# Altium project PCB_Raspi_4B.PrjPcb
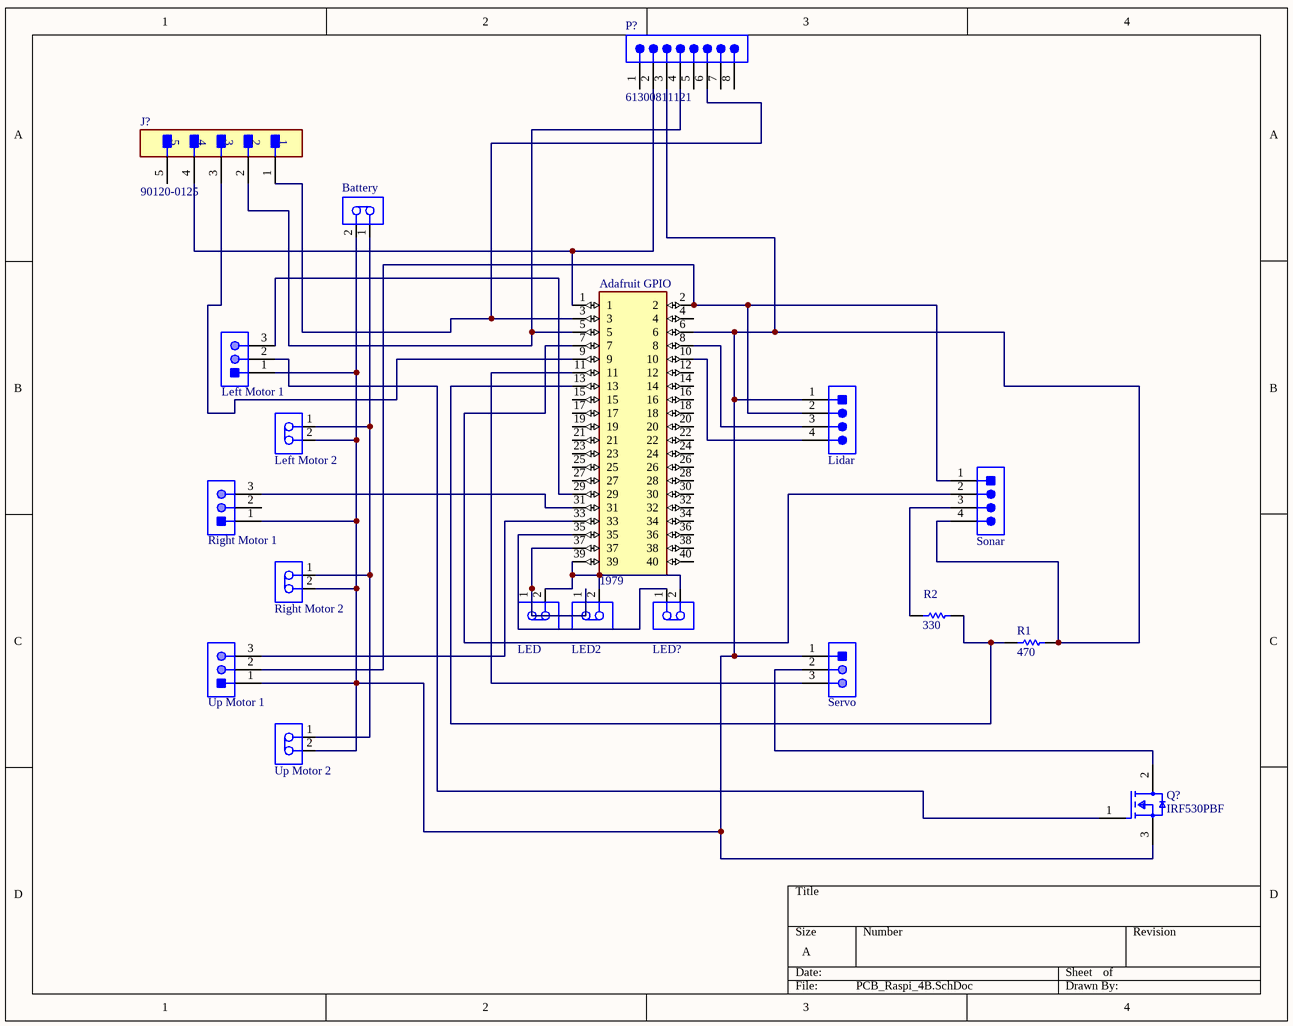
[diagram p0: PCB_Raspi_4B.SchDoc]
1 sheet, 19 parts. Net scope: global (net labels, ports and power ports of the same name join across sheets).
Board file: PCB_Raspi_4B.PcbDoc

## Sheet PCB_Raspi_4B.SchDoc
size A; SheetNumber: 1; SheetTotal: 1

### Parts
Adafruit_GPIO  1979  [RHDR40W60P250_2X20_5100X500X23]
Battery  B2B-PH-K-S(LF)(SN)  [JST-B2B-PH-K-S_V]  (value not drawn)
J?  90120-0125  [FP-90120-0125-MFG]
LED  B2B-PH-K-S(LF)(SN)  [JST-B2B-PH-K-S_V]  (value not drawn)
LED2  B2B-PH-K-S(LF)(SN)  [JST-B2B-PH-K-S_V]  (value not drawn)
LED?  B2B-PH-K-S(LF)(SN)  [JST-B2B-PH-K-S_V]  (value not drawn)
Left_Motor_1  B3B-PH-K-S(LF)(SN)  [JST-B3B-PH-K-S-3_V]  (value not drawn)
Left_Motor_2  B2B-PH-K-S(LF)(SN)  [JST-B2B-PH-K-S_V]  (value not drawn)
Lidar  B4B-PH-K-S(LF)(SN)  [JST-B4B-PH-K-S_V]  (value not drawn)
P?  61300811121  [61300811121]
Q?  IRF530PBF  [FP-X15-0364-MFG]
R1  470  [RESA60-630X240]
R2  330  [RESA60-630X240]
Right_Motor_1  B3B-PH-K-S(LF)(SN)  [JST-B3B-PH-K-S-3_V]  (value not drawn)
Right_Motor_2  B2B-PH-K-S(LF)(SN)  [JST-B2B-PH-K-S_V]  (value not drawn)
Servo  B3B-PH-K-S(LF)(SN)  [JST-B3B-PH-K-S-3_V]  (value not drawn)
Sonar  B4B-PH-K-S(LF)(SN)  [JST-B4B-PH-K-S_V]  (value not drawn)
Up_Motor_1  B3B-PH-K-S(LF)(SN)  [JST-B3B-PH-K-S-3_V]  (value not drawn)
Up_Motor_2  B2B-PH-K-S(LF)(SN)  [JST-B2B-PH-K-S_V]  (value not drawn)

### Nets
NetAdafruit_GPIO_1: Adafruit_GPIO.1 J?.4 P?.2
NetAdafruit_GPIO_2: Adafruit_GPIO.2 Lidar.2 Sonar.1 Up_Motor_1.2
NetAdafruit_GPIO_3: Adafruit_GPIO.3 J?.1 P?.6
NetAdafruit_GPIO_5: Adafruit_GPIO.5 J?.2 P?.4
NetAdafruit_GPIO_6: Adafruit_GPIO.6 Battery.2 Left_Motor_1.1 Left_Motor_2.2 Lidar.1 P?.3 Q?.3(S) R1.1 Right_Motor_1.1 Right_Motor_2.2 Servo.1 Sonar.4 Up_Motor_1.1 Up_Motor_2.2
NetAdafruit_GPIO_7: Adafruit_GPIO.7 Sonar.2
NetAdafruit_GPIO_8: Adafruit_GPIO.8 Lidar.3
NetAdafruit_GPIO_9: Adafruit_GPIO.9 J?.3
NetAdafruit_GPIO_10: Adafruit_GPIO.10 Lidar.4
NetAdafruit_GPIO_11: Adafruit_GPIO.11 Servo.3
NetAdafruit_GPIO_13: Adafruit_GPIO.13 R1.2 R2.1
NetAdafruit_GPIO_29: Adafruit_GPIO.29 Left_Motor_1.3
NetAdafruit_GPIO_31: Adafruit_GPIO.31 Right_Motor_1.3
NetAdafruit_GPIO_33: Adafruit_GPIO.33 Up_Motor_1.3
NetAdafruit_GPIO_35: Adafruit_GPIO.35 LED?.1
NetAdafruit_GPIO_37: Adafruit_GPIO.37 LED.1 LED2.1
NetAdafruit_GPIO_39: Adafruit_GPIO.39 LED.2 LED2.2 LED?.2
NetBattery_1: Battery.1 Left_Motor_2.1 Right_Motor_2.1 Up_Motor_2.1
NetLeft_Motor_1_2: Left_Motor_1.2 Q?.1(G)
NetQ?_2: Q?.2(D) Servo.2
NetR2_2: R2.2 Sonar.3

Not connected (* = marked no-connect by the designer): Adafruit_GPIO 4 12 14 15 16 17 18 19 20 21 22 23 24 25 26 27 28 30 32 34 36 38 40; J? 5; P? 1 5 7 8; Right_Motor_1 2

### Library data of the parts
Adafruit_GPIO = CMP-002-00071-1: Stacking Header for Pi A+/B+/Pi 2/Pi 3 - 2x20 Extra Tall Header; MF: Adafruit Industries; Pins: 40; MP: 1979; SnapEDA_Link: https://www.snapeda.com/parts/1979/Adafruit+Industries+LLC/view-part/?ref=snap; Source: 1979.SchLib; Design Item ID: 1979; Value: *; Check_prices: https://www.snapeda.com/parts/1979/Adafruit+Industries+LLC/view-part/?ref=eda; Case/Package: None; Component Type: Standard
Battery LED Left_Motor_2 Right_Motor_2 Up_Motor_2 = CMP-2000-05162-1: Male Header, Pitch 2 mm, 1 x 2 Position, Height 6 mm, Tail Length 3.4 mm, -25 to 85 degC, RoHS, Bulk; Manufacturer: JST; Pitch: 2mm; Style/Orientation: StraightHeader/Plug; No of Positions: 2; Datasheet Version: Nov-08; Datasheet URL: http://datasheet.octopart.com/B2B-PH-K-S%28LF%29%28SN%29-JST-datasheet-8324864.pdf; Manufacturer URL: http://www.jst.com/home2.html; Type: ShroudedHeader; Termination: Crimp
J? = CMP-00257-00655425-1: 90120-0125 2.54mm Pitch C-Grid III Header, Single Row, Vertical, 5 Circuits, Tin (Sn) Plating; NexarPartId: 655425; Manufacturer Lifecycle Status: ACTIVE; Lead Length: 2.9mm; Number of Positions: 5; Current Rating: 3A; Mating Post Length: 6.75mm; Glow Wire Compliant: Non-compliant; Contact Resistance: 20mΩ; Voltage Rating: 350V; Gender: Male; Max Voltage Rating (DC): 350.35kV; Max Operating Temperature: 125°C; Number of Pins: 5; Plating: Tin; Contact Material: Brass; Mount: Through Hole; Contact Gender: Male; Packaging: Bulk; Schedule B: 8536694040; Lifecycle Status: Production; Lead Pitch: 2.54mm; Radiation Hardening: No; Orientation: Vertical; Min Operating Temperature: -55°C; Country of Origin: SK; Housing Color: Black; REACH SVHC: No SVHC; Contact Plating: Tin; Number of Rows: 1; Number of Circuits: 5; Termination: Solder; Number of Contacts: 5; Pitch: 2.54mm; Housing Material: Polyester; RoHS: Compliant; Lead Free: Lead Free; Voltage Rating (AC): 350V
LED2 LED? = CMP-2000-05162-1: Male Header, Pitch 2 mm, 1 x 2 Position, Height 6 mm, Tail Length 3.4 mm, -25 to 85 degC, RoHS, Bulk; Manufacturer: JST; Pitch: 2mm; Style/Orientation: StraightHeader/Plug; No of Positions: 2; Type: ShroudedHeader; Datasheet Version: Nov-08; Datasheet URL: http://datasheet.octopart.com/B2B-PH-K-S%28LF%29%28SN%29-JST-datasheet-8324864.pdf; Manufacturer URL: http://www.jst.com/home2.html; Termination: Crimp
Left_Motor_1 Right_Motor_1 Servo Up_Motor_1 = CMP-2000-05164-1: Male Header, Pitch 2 mm, 1 x 3 Position, Height 6 mm, Tail Length 3.4 mm, -25 to 85 degC, RoHS, Bulk; Manufacturer: JST; Style/Orientation: StraightHeader/Plug; Pitch: 2mm; No of Positions: 3; Termination: Crimp; Manufacturer URL: http://www.jst.com/home2.html; Datasheet Version: Oct-06; Type: ShroudedHeader; Datasheet URL: https://datasheet.ciiva.com/11746/0900766b80826550-11746939.pdf
Lidar Sonar = CMP-2000-05165-1: Male Header, Pitch 2 mm, 1 x 4 Position, Height 6 mm, Tail Length 3.4 mm, -25 to 85 degC, RoHS, Bulk; Manufacturer: JST; No of Positions: 4; Style/Orientation: StraightHeader/Plug; Pitch: 2mm; Datasheet URL: http://datasheet.octopart.com/B4B-PH-K-S%28LF%29%28SN%29-JST-datasheet-10558886.pdf; Type: ShroudedHeader; Manufacturer URL: http://www.jst.com/home2.html; Termination: Crimp; Datasheet Version: Apr-09
P? = CMP-1502-01076-3: NexarPartId: 32855533; Connector Type: Male Pin; Number of Contacts: 8; Voltage Rating: 250V; Current Rating: 3A; Contact Resistance: 20mΩ; Pitch: 2.54mm; Gender: Male; Termination: Solder; Contact Material: Copper; Mount: Through Hole; Lead Pitch: 2.54mm; Number of Positions: 8; Operating Supply Voltage: 250V; Number of Pins: 8; Max Operating Temperature: 105°C; Height: 8.54mm; REACH SVHC: Unknown; Number of Rows: 1; Packaging: Bulk; Contact Plating: Gold; Contact Mating Length: 5.9944mm; Orientation: Vertical; RoHS: Compliant; Color: Black; Min Operating Temperature: -40°C
Q? = CMP-02550-000190-1: MOSFET N-CH 100V 14A TO-220AB; Manufacturer: Vishay; Reverse Recovery Charge: 850nC; Rthja Max: 62°C/W; Power Dissipation: 88W; Depletion Mode: False; Input Capacitace At Vds: 670pF @ 25V; Pulse Drain Current: 56A; Turn On Delay Time: 10ns; Drain To Source Resistance: 0.16Ω; Number Of N Channels: 1; Max Junction Temp: +175°C; Threshold Vgs Max: 4V; Standoff Height: 3.33mm; Max Forward Diode Voltage: 2.5V; Turn Off Delay Time: 23ns; Gate To Source Voltage: 20V; Threshold Vgs Min: 2V; Reverse Recovery Time: 150ns; Gate Charge At Vgs: 26nC @ 10V; Temperature: -55°C to +175°C; Drain To Source Voltage: 100V; Mouser Description: MOSFET N-Chan 100V 14 Amp; Device Class L2: Transistors; Temperature Range High: +175°C; ComponentLink2URL: http://www.vishay.com/docs/91019/91019.pdf; Lead Free: Yes; Height: 19.89mm; Octopart: https://octopart.com/irf530pbf-vishay-46547999; Category: Trans; ComponentLink2Description: Datasheet; RoHS: TRUE; Device Class L3: MOSFETs; Automotive: No; Device Class L1: Discrete Semiconductors; Package: X15-0364; Manufacturer Part Number: IRF530PBF; Continuous Drain Current: 14A; Digikey Description: MOSFET N-CH 100V 14A TO-220AB; Number Of Channels: 1; Drain To Source Breakdown Voltage: 100V; Temperature Range Low: -55°C
R1 R2 = CMP-1659-00073-1: Axial Resistor, 100 KOhm, +/- 1%, 0.25 W, -55 to 155 degC, 2-Pin THD, RoHS, Bulk; Voltage Rating: 250 V; Power Rating: 250 mW; Resistance: 475 Ohm; PackageDescription: 2-Pin Axial Lead, Dia 2.4 mm, Body Length 6.3 mm; PackageReference: MFR-25; Length: 0.248 inch; ComponentLink2Description: Datasheet; Packaging: Bulk; DatasheetVersion: Apr-13; Package Quantity: 200; Min Operating Temperature: -55 degC; ComponentLink2URL: http://www.yageo.com/documents/recent/Yageo%20LR_MFR_2013.pdf; RoHSCompliant: true; ComponentLink1URL: http://www.yageo.com/; Tolerance: 1%; Case\Package: Axial; Mount: Through Hole; ComponentLink1Description: Manufacturer URL; Max Operating Temperature: 155 degC